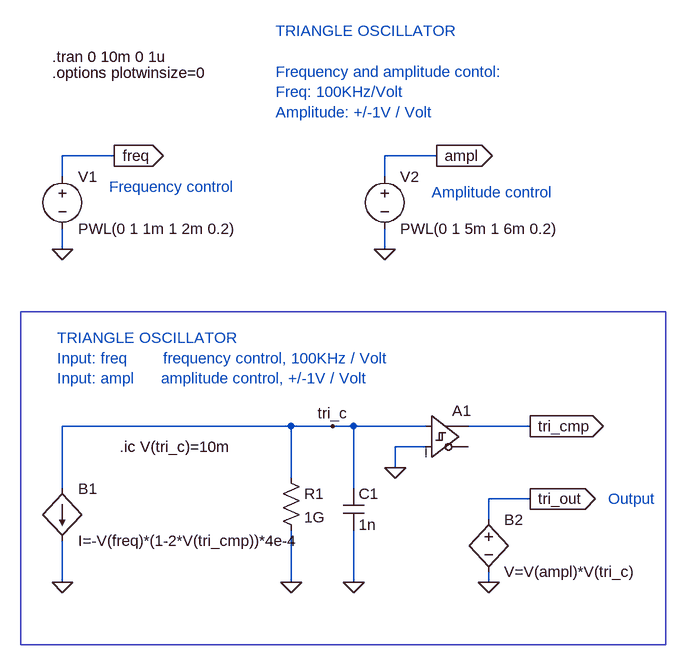
[diagram p0: schematic Triangle_osc_fm_am1.asc]
Triangle_osc_fm_am1.asc, the LTspice schematic file:
Version 4
SHEET 1 1272 932
WIRE -464 -240 -544 -240
WIRE 32 -240 -48 -240
WIRE -544 -208 -544 -240
WIRE -48 -208 -48 -240
WIRE -544 -96 -544 -128
WIRE -48 -96 -48 -128
WIRE -192 176 -544 176
WIRE -128 176 -192 176
WIRE -96 176 -128 176
WIRE 16 176 -96 176
WIRE 176 176 80 176
WIRE 16 208 -32 208
WIRE -32 240 -32 208
WIRE -192 256 -192 176
WIRE -544 272 -544 176
WIRE -96 272 -96 176
WIRE 176 288 112 288
WIRE 112 320 112 288
WIRE -544 416 -544 352
WIRE -192 416 -192 336
WIRE -96 416 -96 336
WIRE 112 416 112 400
FLAG -96 416 0
FLAG -32 240 0
FLAG 176 176 tri_cmp
IOPIN 176 176 Out
FLAG -544 416 0
FLAG -192 416 0
FLAG -128 176 tri_c
FLAG 176 288 tri_out
IOPIN 176 288 Out
FLAG 112 416 0
FLAG -544 -96 0
FLAG -464 -240 freq
IOPIN -464 -240 Out
FLAG -48 -96 0
FLAG 32 -240 ampl
IOPIN 32 -240 Out
SYMBOL cap -112 272 R0
SYMATTR InstName C1
SYMATTR Value 1n
SYMBOL bi -544 272 R0
SYMATTR InstName B1
SYMATTR Value I=-V(freq)*(1-2*V(tri_cmp))*4e-4
SYMBOL res -208 240 R0
SYMATTR InstName R1
SYMATTR Value 1G
SYMBOL bv 112 304 R0
SYMATTR InstName B2
SYMATTR Value V=V(ampl)*V(tri_c)
SYMATTR Value2 tripdt=0.1u
SYMBOL voltage -544 -224 R0
WINDOW 123 0 0 Left 0
WINDOW 39 0 0 Left 0
SYMATTR InstName V1
SYMATTR Value PWL(0 1 1m 1 2m 0.2)
SYMBOL voltage -48 -224 R0
WINDOW 123 0 0 Left 0
WINDOW 39 0 0 Left 0
SYMATTR InstName V2
SYMATTR Value PWL(0 1 5m 1 6m 0.2)
SYMBOL Digital\\diffschmitt 16 128 R0
SYMATTR InstName A1
SYMATTR SpiceLine Vt=0 Vh=1
SYMATTR SpiceLine2 trise=10n tripdt=10n
TEXT -560 -392 Left 0 !.tran 0 10m 0 1u
TEXT -456 208 Left 0 !.ic V(tri_c)=10m
TEXT -560 -368 Left 0 !.options plotwinsize=0
TEXT -216 -432 Left 0 ;TRIANGLE OSCILLATOR\n \nFrequency and amplitude contol:\nFreq: 100KHz/Volt\nAmplitude: +/-1V / Volt
TEXT -472 -192 Left 0 ;Frequency control
TEXT 24 -184 Left 0 ;Amplitude control
TEXT -552 40 Left 0 ;TRIANGLE OSCILLATOR \nInput: freq        frequency control, 100KHz / Volt\nInput: ampl      amplitude control, +/-1V / Volt
TEXT 296 288 Left 0 ;Output
RECTANGLE Normal 384 512 -608 0

The netlist it stands for:
* Triangle_osc_fm_am1.asc
C1 tri_c 0 1n
B1 tri_c 0 I=-V(freq)*(1-2*V(tri_cmp))*4e-4
R1 tri_c 0 1G
B2 tri_out 0 V=V(ampl)*V(tri_c) tripdt=0.1u
V1 freq 0 PWL(0 1 1m 1 2m 0.2)
V2 ampl 0 PWL(0 1 5m 1 6m 0.2)
A1 tri_c 0 0 0 0 0 tri_cmp 0 SCHMITT Vt=0 Vh=1 trise=10n tripdt=10n
.tran 0 10m 0 1u
.ic V(tri_c)=10m
.options plotwinsize=0
* TRIANGLE OSCILLATOR
* Frequency and amplitude contol:
* Freq: 100KHz/Volt
* Amplitude: +/-1V / Volt
* Frequency control
* Amplitude control
* TRIANGLE OSCILLATOR
* Input: freq        frequency control, 100KHz / Volt
* Input: ampl      amplitude control, +/-1V / Volt
* Output
.backanno
.end